# EAGLE schematic BMS_watchdog (EAGLE 7.7.0)
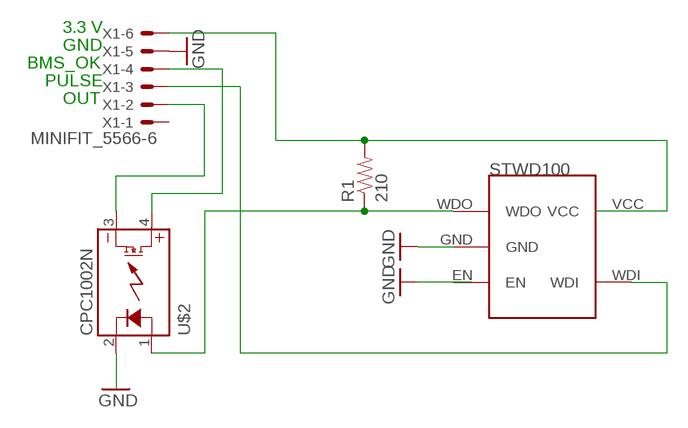
[diagram p0: schematic, sheet 1]

## Parts
R1  210  RESISTOR0805-RES  [0805]
U$1  STWD100  [SOT23-5]
U$2  CPC1002N  [SOP04]
X1  MINIFIT_5566-6  [MINIFIT_5566-6]

## Nets
GND: U$1.GND X1.5
N$1: R1.2 X1.6
N$2: U$1.WDI X1.3
N$3: R1.1 U$1.WDO U$2.1(CONTROL+)
N$4: U$2.4(DC+) X1.4
N$5: U$2.3(DC-) X1.2
N$6: U$2.2(CONTROL-)
Unconnected: U$1.EN U$1.VCC X1.1

## Notes on the sheet
- 3.3 V
- GND
- BMS_OK
- PULSE
- OUT

## Library data of the parts
R1 = HyTechDevices:RESISTOR: Resistor Basic schematic elements and footprints for 0603, 1206, and PTH resistors.
U$1 = HyTechDevices:STWD100: STWD100 Watchdog timer
U$2 = HyTechDevices:CPC1002N: IXYS Solid State Relay .7A
X1 = HyTechDevices:MINIFIT_5566-6: Mini-Fit Junior connector 6 pole Source: http://www.molex.com; MPN: 95566-61002; OC_FARNELL: unknown; OC_NEWARK: 22K8620